# EAGLE board IoT Node(Ver1.0) (EAGLE 9.3.0), part 1 of 2
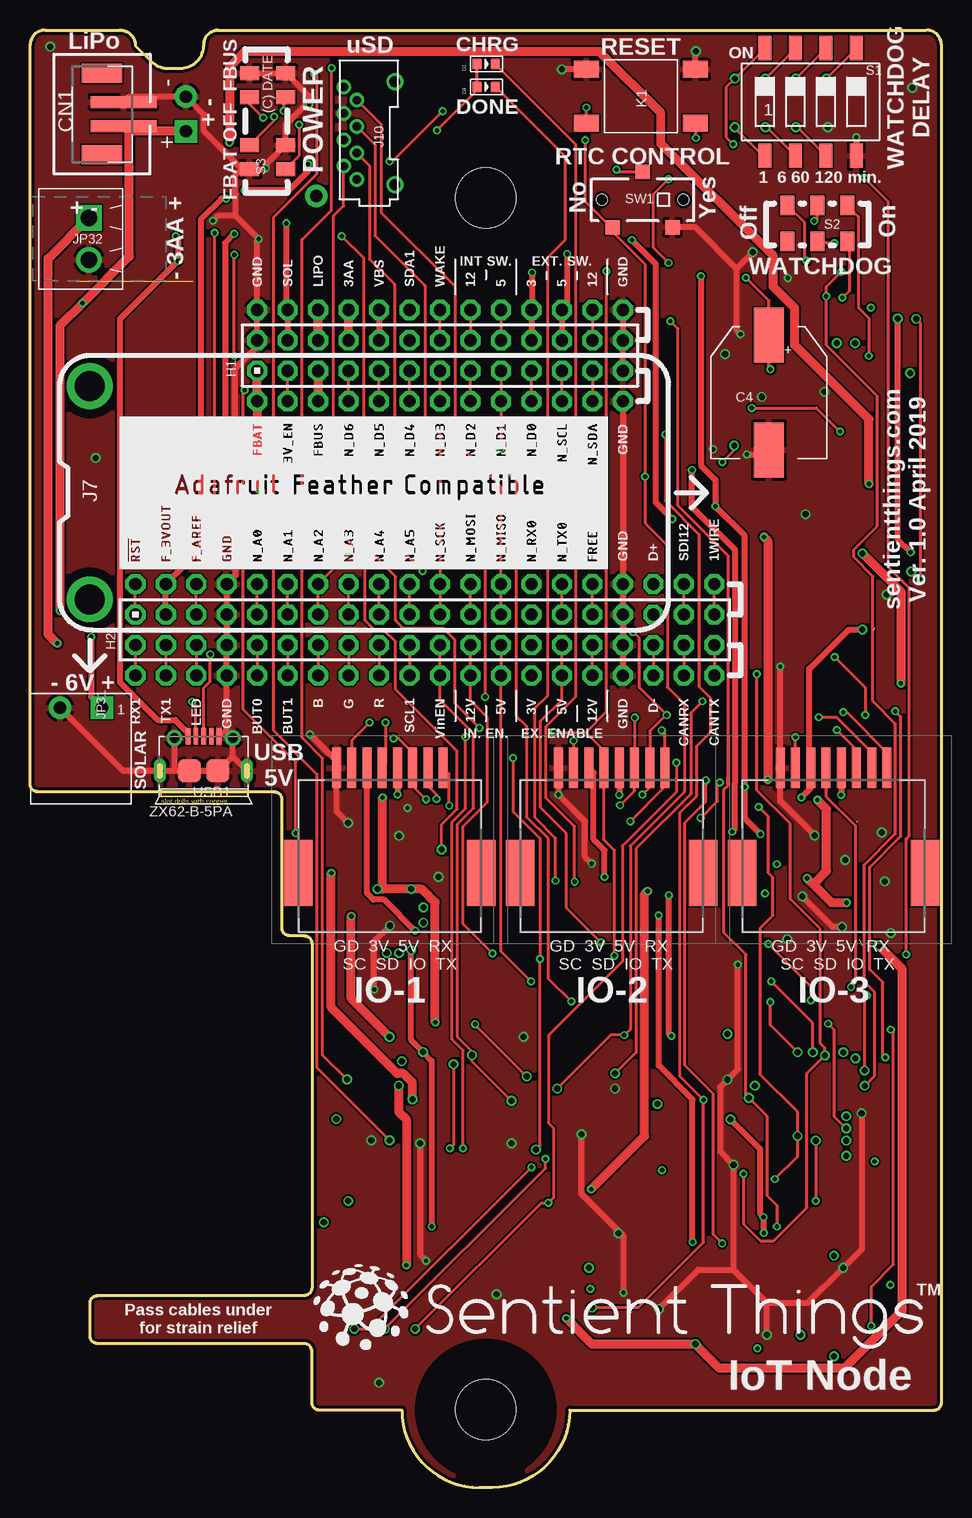
[diagram p1: board, top side]
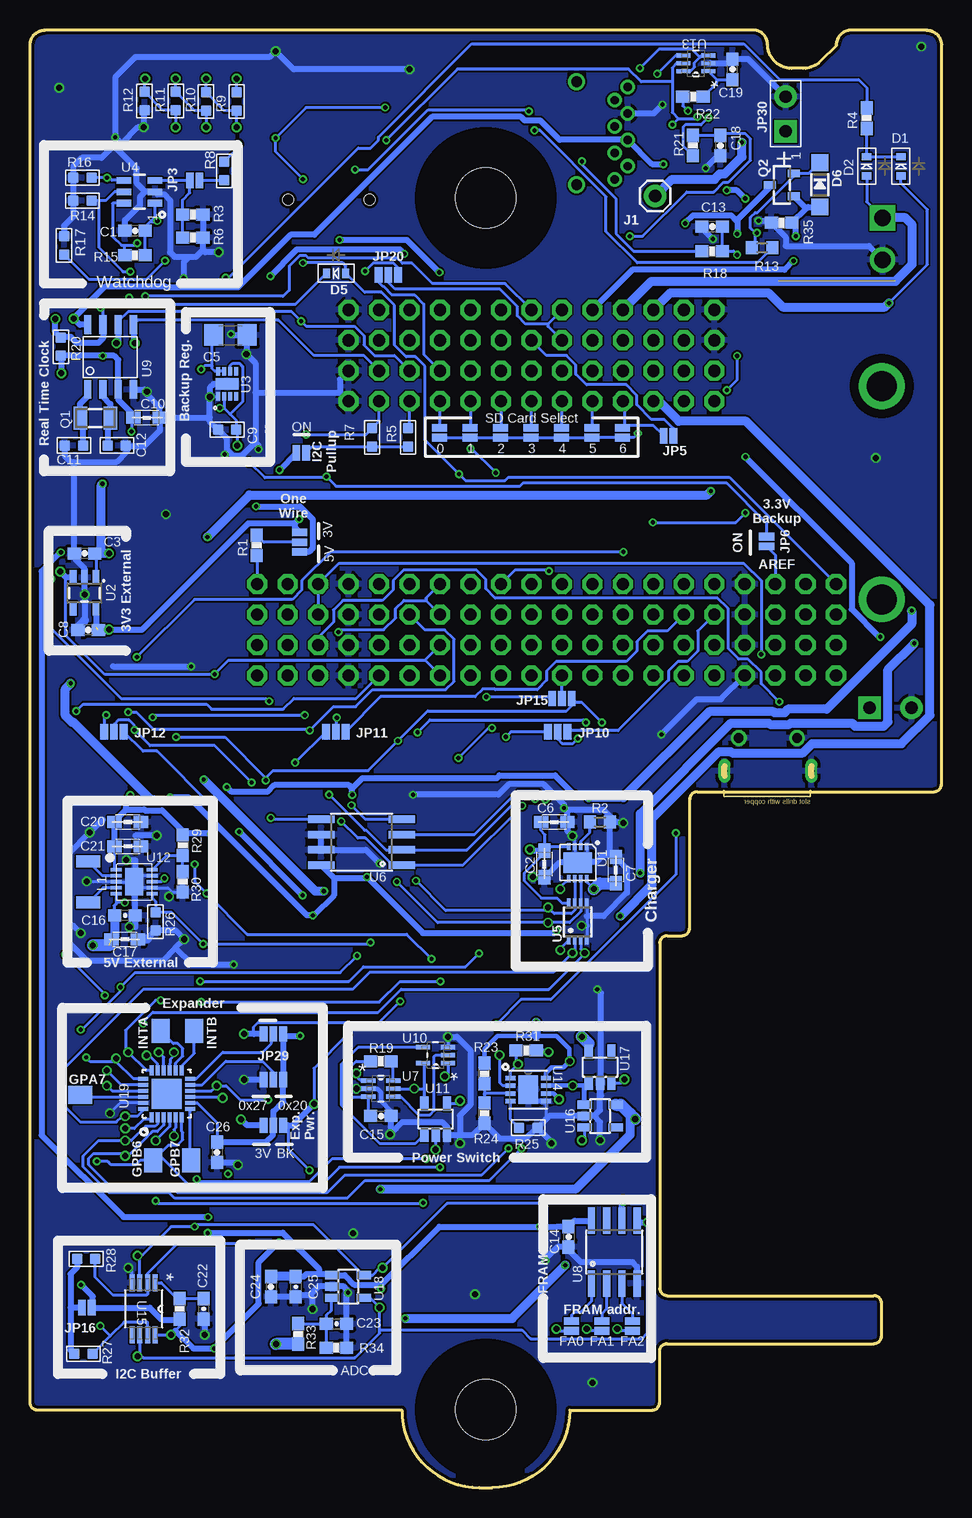
[diagram p2: board, bottom side, seen from below]

Size 76 x 121.5 mm. Coordinates in mm from the lower left corner, seen from the top.
Outline: 20.36,58 0.63,58 arc-90 0,58.63 0,120.23 arc-90 1.27,121.5 7.5,121.5 arc-90 8.79,120.2 10.11,118.89 arc45 11.52,118.3 12.5,118.3 arc90 14.5,120.3 arc-90 15.7,121.5 74.73,121.5 arc-90 76,120.23 76,91.63 76,74.05 76,7.09 arc-90 75.37,6.45 45,6.45 arc-90 38.55,0 37.45,0 arc-90 31,6.45 24.13,6.45 arc-90 23.5,7.09 23.5,11.37 arc90 22.87,12 5.63,12 arc-90 5,12.63 5,15.37 arc-90 5.63,16 22.87,16 arc90 23.5,16.63 23.5,45.37 arc90 22.87,46 21.64,46 arc-90 21,46.63 21,57.37 arc90 20.36,58
Copper layers (1*16): Top 0.035mm / dielectric 1.5mm / Bottom 0.035mm
Design rules "SeeedStudio_2layer_DRU_no_angle_20140221 *": minimum track width 8mil, minimum drill 14mil, track to track 6mil, track to pad 6mil, pad to pad 6mil, via to via 6mil, smd to smd 0mil, copper to edge 10mil, drill to drill 10mil, minimum pad ring 10mil, minimum via ring 6mil, stop-mask expansion 2mil, vias tented up to drill 100mil, thermal gap 10mil
Net classes: 0 default: width 0.254 mm, drill 0.356 mm, clearance 0.152 mm; 1 Power: width 0.508 mm, drill 0.356 mm, clearance 0.152 mm; 2 HighCurrent: width 0.762 mm, drill 0.356 mm, clearance 0.152 mm
Holes 5 mm at 38,107.5 38,6.5
bKeepout: area 34,103.5 to 42,111.5; area 34,2.5 to 42,10.5
tRestrict: area 34,103.5 to 42,111.5; area 34,2.5 to 42,10.5
bRestrict: area 34,103.5 to 42,111.5; area 34,2.5 to 42,10.5

## Footprints (pad centres in the part's own frame; a part is rotated, then mirrored left to right if it is on the bottom)
0603-CAP = smd 1.1 x 1: 1 -0.85,0; 2 0.85,0
0805 = smd 1.2 x 1: 1 -1.1,0; 2 1.1,0
CAP-10.5MM = smd 4.6 x 2.5: +VE 4.8,0; -VE -4.8,0
C1206 = smd 1.6 x 1.8: 1 -1.4,0; 2 1.4,0
C0603 = smd 0.889 x 0.889: 1 0,0.762; 2 0,-0.762
0603 = smd 0.889 x 0.889: 1 -0.762,0; 2 0.762,0
JST-PH-2-SMT = smd 1 x 5.5: 1 -1,-1.8; 2 1,-1.8 | smd 1.6 x 3.4: NC1 -3.4,0; NC2 3.4,0
SOD-523 = smd 0.8 x 0.6: A 0,-0.8; K 0,0.8
D0603 = smd 0.762 x 0.889: + -0.762,0; - 0.762,0
SOD-123 = smd 1.4 x 1.4: A 1.85,0; C -1.85,0
PAD-1.5X4.5 = smd 1.5 x 2: P$1 0,0
73304111LF = smd 3.4 x 0.76: 1 -6,4.445; 2 -6,3.175; 3 -6,1.905; 4 -6,0.635; 5 -6,-0.635; 6 -6,-1.905; 7 -6,-3.175; 8 -6,-4.445 | smd 5.5 x 2.35: MP1 2.75,7.62; MP2 2.75,-7.62
1X01 = drill 1.016 pad 1.88: 1 0,0
M20NODE = drill 1.016 pad 1.676 octagon: 1 0,0; 2 2.54,0; 3 5.08,0; 4 7.62,0; 5 10.16,0; 6 12.7,0; 7 15.24,0; 8 17.78,0; 9 20.32,0; 10 22.86,0; 11 25.4,0; 12 27.94,0; 13 30.48,0; 14 33.02,0; 15 35.56,0; 16 38.1,0; 17 40.64,0; 18 43.18,0; 19 45.72,0; 20 48.26,0
IOTNODE = drill 1.016 pad 1.676 octagon: 1WIRE 29.21,-10.16; 3AA -1.27,12.7; 3VEN -6.35,10.16; 3VEXT 13.97,12.7; 5VEXT 16.51,12.7; 5VINT 11.43,12.7; 12VEXT 19.05,12.7; 12VINT 8.89,12.7; !RST -19.05,-10.16; B -3.81,-12.7; BUT0 -8.89,-12.7; BUT1 -6.35,-12.7; CANRX 26.67,-12.7; CANTX 29.21,-12.7; D+ 24.13,-10.16; D- 24.13,-12.7; EN3VEX 13.97,-12.7; EN5VEX 16.51,-12.7; EN5VIN 11.43,-12.7; EN12VEX 19.05,-12.7; EN12VIN 8.89,-12.7; F3VOUT -16.51,-10.16; FAREF -13.97,-10.16; FBAT -8.89,10.16; FBUS -3.81,10.16; FREE 19.05,-10.16; G -1.27,-12.7; GND -8.89,12.7; GND0 -11.43,-12.7; GND1 21.59,-12.7; GND2 21.59,-10.16; GND3 -11.43,-10.16; GND4 21.59,12.7; GND5 21.59,10.16; LED -13.97,-12.7; LIPO -3.81,12.7; NA0 -8.89,-10.16; NA1 -6.35,-10.16; NA2 -3.81,-10.16; NA3 -1.27,-10.16; NA4 1.27,-10.16; NA5 3.81,-10.16; ND0 13.97,10.16; ND1 11.43,10.16; ND2 8.89,10.16; ND3 6.35,10.16; ND4 3.81,10.16; ND5 1.27,10.16; ND6 -1.27,10.16; NMISO 11.43,-10.16; NMOSI 8.89,-10.16; NRX0 13.97,-10.16; NSCK 6.35,-10.16; NSCL 16.51,10.16; NSDA 19.05,10.16; NTX0 16.51,-10.16; R 1.27,-12.7; RX1 -19.05,-12.7; SCL1 3.81,-12.7; SDA1 3.81,12.7; SDI12 26.67,-10.16; SOL -6.35,12.7; TX1 -16.51,-12.7; VBS 1.27,12.7; VINEN 6.35,-12.7; WAKE 6.35,12.7 | drill 2.5 pad 3.81: P$1 -22.86,8.89; P$2 -22.86,-8.89
1X13NODE = drill 1.016 pad 1.676 octagon: 1 0,0; 2 2.54,0; 3 5.08,0; 4 7.62,0; 5 10.16,0; 6 12.7,0; 7 15.24,0; 8 17.78,0; 9 20.32,0; 10 22.86,0; 11 25.4,0; 12 27.94,0; 13 30.48,0
MICROSDYAMAICHI = drill 0.7 pad 1.016: 1 -3.85,0; 2 -2.75,1.1; 3 -1.65,0; 4 -0.55,1.1; 5 0.55,0; 6 1.65,1.1; 7 2.75,0; 8 3.85,1.1 | drill 0.9: P1 -4.3,-3.17; P2 4.3,-3.17
SMT-JUMPER_3_1-NC_PASTE_NO-SILK = smd 0.635 x 1.27: 1 -0.813,0; 2 0,0; 3 0.813,0
SMT-JUMPER_2_NC_PASTE_NO-SILK = smd 0.635 x 1.27: 1 -0.406,0; 2 0.406,0
SMT-JUMPER_2_NO_NO-SILK = smd 0.635 x 1.27: 1 -0.406,0; 2 0.406,0
1X02_LOCK_FEM = drill 1.016 pad 1.88 square: 1 -1.448,0 | drill 1.016 pad 1.88: 2 1.448,0
1X02-3.5-HOR = drill 1.016 pad 1.88 square: 1 0,0 | drill 1.016 pad 1.88: 2 3.5,0
1X02_3.5TERM = drill 1.4 square: 1 -1.75,0 | drill 1.4: 2 1.75,0
TACTILE6MM-ESWITCH = smd 2.1 x 1.4: 1 -4.55,2.25; 2 -4.55,-2.25; 3 4.55,-2.25; 4 4.55,2.25
2520 = smd 1 x 2: L1 -1.7,0; L2 1.7,0
FC135 = smd 1.1 x 1.9: X1 -1.25,0; X2 1.25,0
SOT23-R = smd 0.635 x 1.016: 1 -0.95,-1; 2 0.95,-1; 3 0,1
0603-RES = smd 1.1 x 1: 1 -0.85,0; 2 0.85,0
R0603 = smd 1 x 1.1: 1 -0.85,0; 2 0.85,0
R0603' = smd 0.889 x 0.889: 1 0,0.762; 2 0,-0.762
SMS-004 = smd 1.092 x 2.007: 1 -3.81,-4.496; 2 -1.27,-4.496; 3 1.27,-4.496; 4 3.81,-4.496; 5 3.81,4.496; 6 1.27,4.496; 7 -1.27,4.496; 8 -3.81,4.496
CL-SB-22A = smd 1.2 x 1.6: 1 -2.5,-1.6; 2(C) 0,-1.6; 3 2.5,-1.6; 4 -2.5,1.4; 5(C) 0,1.4; 6 2.5,1.4
CL-SB-23A = smd 1.2 x 1.6: 1 -4,-1.6; 2 -2,-1.6; 3(C) 2,-1.6; 4 4,-1.6; 5 -4,1.4; 6 -2,1.4; 7(C) 2,1.4; 8 4,1.4
CL-SB-12B = smd 1.2 x 1.2: 1 -2.5,-2.3; 3 2.5,-2.3; C(2) 0,2.3 | hole 0.9: -3.4,0; 3.4,0
DFN8 = smd 0.3 x 0.6: 1 -0.75,-1.35; 2 -0.25,-1.35; 3 0.25,-1.35; 4 0.75,-1.35; 5 0.75,1.35; 6 0.25,1.35; 7 -0.25,1.35; 8 -0.75,1.35 | smd 2.4 x 1.7: HEAT 0,0
SOT23-5 = smd 0.55 x 1.2: 1 -0.95,-1.3; 2 0,-1.3; 3 0.95,-1.3; 4 0.95,1.3; 5 -0.95,1.3
8VDFN = smd 0.3 x 0.7: 1 -0.75,-1.05; 2 -0.25,-1.05; 3 0.25,-1.05; 4 0.75,-1.05; 5 0.75,1.05; 6 0.25,1.05; 7 -0.25,1.05; 8 -0.75,1.05 | smd 1.95 x 0.95: H 0,0
SOT23-6 = smd 0.55 x 1.2: 1 -0.95,-1.3; 2 0,-1.3; 3 0.95,-1.3; 4 0.95,1.3; 5 0,1.3; 6 -0.95,1.3
US8-DCU = smd 0.3 x 0.75: 1 -0.75,-1.5; 2 -0.25,-1.5; 3 0.25,-1.5; 4 0.75,-1.5; 5 0.75,1.6; 6 0.25,1.6; 7 -0.25,1.6; 8 -0.75,1.6
SOIC-8-STANDARD = smd 0.61 x 2.21: 1 -1.905,-3.378; 2 -0.635,-3.378; 3 0.635,-3.378; 4 1.905,-3.378; 5 1.905,3.353; 6 0.635,3.353; 7 -0.635,3.353; 8 -1.905,3.353
SOT65P210X110-6N = smd 1.168 x 0.356: 1 -1.041,0.66; 2 -1.041,0; 3 -1.041,-0.66; 4 1.041,-0.66; 5 1.041,0; 6 1.041,0.66
SO08 = smd 0.61 x 2.21: 1 -1.905,-2.616; 2 -0.635,-2.616; 3 0.635,-2.616; 4 1.905,-2.616; 5 1.905,2.616; 6 0.635,2.616; 7 -0.635,2.616; 8 -1.905,2.616
RTC_MCP7941X = smd 0.6 x 1.55: 1 -1.905,-2.7; 2 -0.635,-2.7; 3 0.635,-2.7; 4 1.905,-2.7; 5 1.905,2.7; 6 0.635,2.7; 7 -0.635,2.7; 8 -1.905,2.7
SOT65P210X110-5N = smd 1.168 x 0.356: 1 -1.041,0.66; 2 -1.041,0; 3 -1.041,-0.66; 4 1.041,-0.66; 5 1.041,0.66
SOT23-5' = smd 0.69 x 1.2: 1 -0.95,-1.3; 2 0,-1.3; 3 0.95,-1.3; 4 0.95,1.3; 5 -0.95,1.3
DFN103X3 = smd 0.9 x 0.3: 1 -1.5,1; 2 -1.5,0.5; 3 -1.5,0; 4 -1.5,-0.5; 5 -1.5,-1; 6 1.5,-1; 7 1.5,-0.5; 8 1.5,0; 9 1.5,0.5; 10 1.5,1 | smd 1.5 x 2.3: G 0,0
SON65P300X300X100-9N = smd 0.813 x 0.381: 1 -1.473,0.965; 2 -1.473,0.33; 3 -1.473,-0.33; 4 -1.473,-0.965; 5 1.473,-0.965; 6 1.473,-0.33; 7 1.473,0.33; 8 1.473,0.965 | smd 1.651 x 2.388: 9 0,0
SOP65P490X110-8N = smd 1.422 x 0.432: 1 -2.184,0.965; 2 -2.184,0.33; 3 -2.184,-0.33; 4 -2.184,-0.965; 5 2.184,-0.965; 6 2.184,-0.33; 7 2.184,0.33; 8 2.184,0.965
QFN24-4MM = smd 0.85 x 0.3: 1 -1.95,1.25; 2 -1.95,0.75; 3 -1.95,0.25; 4 -1.95,-0.25; 5 -1.95,-0.75; 6 -1.95,-1.25; 13 1.95,-1.25; 14 1.95,-0.75; 15 1.95,-0.25; 16 1.95,0.25; 17 1.95,0.75; 18 1.95,1.25 | smd 0.3 x 0.85: 7 -1.25,-1.95; 8 -0.75,-1.95; 9 -0.25,-1.95; 10 0.25,-1.95; 11 0.75,-1.95; 12 1.25,-1.95; 19 1.25,1.95; 20 0.75,1.95; 21 0.25,1.95; 22 -0.25,1.95; 23 -0.75,1.95; 24 -1.25,1.95 | smd 2.5 x 2.5: S 0,0
MICRO-USB5+6P-SMD-0.65-AB = smd 0.4 x 1.35: 1 -1.3,2.875; 2 -0.65,2.875; 3 0,2.875; 4 0.65,2.875; 5 1.3,2.875 | smd 1.9 x 1.9: P1 -1.2,0; P2 1.2,0 | drill 0.508 pad 1.016 long: P3 -3.625,0; P4 3.625,0 | drill 0.8: P5 -2.425,2.73; P6 2.425,2.73

## Placement (x,y rotation side)
C1  1uF  [0603-CAP]  67.24,104.75 180 bottom
C2  10uF  [0805]  33.12,51.97 270 bottom
C3  1uF  [0603-CAP]  71.44,77.87 180 bottom
C4  47mF  [CAP-10.5MM]  61.61,91.28 90 top
C5  100uF 6.3V  [C1206]  59.29,96.07 0 bottom
C6  10uF  [0805]  32.29,55.47 0 bottom
C7  4.7uF  [0805]  27.16,51.46 90 bottom
C8  1uF  [0603-CAP]  71.15,71.48 180 bottom
C9  2.2uf  [C0603]  59.56,88.18 90 bottom
C10  100pF  [0805]  66.27,89.18 180 bottom
C11  9pF  [0603]  72.32,86.87 0 bottom
C12  9pF  [0603]  68.77,86.87 180 bottom
C13  1uF  [0603-CAP]  19.12,105.1 180 bottom
C14  1uF  [0603-CAP]  31.09,20.9 270 bottom
C15  1uF  [0603-CAP]  46.75,30.96 0 bottom
C16  0.1uF  [0603-CAP]  68.08,47.69 180 bottom
C17  10uF  [0805]  68.1,45.7 0 bottom
C18  1uF  [0603-CAP]  18.44,111.86 270 bottom
C19  1uF  [0603-CAP]  17.43,118.21 90 bottom
C20  10uF  [0805]  67.84,55.48 0 bottom
C21  10uF  [0805]  67.84,53.44 0 bottom
C22  0.1uF  [0603-CAP]  61.52,14.9 270 bottom
C23  0.1uF  [0603-CAP]  50.44,13.65 0 bottom
C24  1uF  [0603-CAP]  55.91,16.74 270 bottom
C25  0.1uF  [0603-CAP]  53.84,16.74 270 bottom
C26  1uF  [0603-CAP]  60.41,27.94 270 bottom
CN1  B2B-PH-SM4-TB(LF)(SN)  [JST-PH-2-SMT]  6,114.5 90 top
D1  RB520S30T1G  [SOD-523]  3.38,110.14 0 bottom
D2  RB520S30T1G  [SOD-523]  6.24,110.13 0 bottom
D3  LTST-C193KRKT-5A  [D0603]  38.05,118.66 0 top
D4  LTST-C190KGKT  [D0603]  38.05,116.76 0 top
D5  RB520S30T1G  [SOD-523]  50.48,101.22 90 bottom
D6  BS819W  [SOD-123]  10.14,108.59 270 bottom
FRAME1  FRAME-LEDGER  [CREATIVE_COMMONS]  10.06,-26.82 0 top  (outside the outline)
GPA7  [PAD-1.5X4.5]  71.83,32.73 270 bottom
GPB6  [PAD-1.5X4.5]  65.74,27.27 0 bottom
GPB7  [PAD-1.5X4.5]  62.56,27.27 0 bottom
H1  Pi2x13extratall  [2X13PLACEMENT]  18.95,93.09 0 top
H2  Pi2x20extratall  [2X20PLACEMENT]  8.79,70.23 0 top
INTA  [PAD-1.5X4.5]  65.1,38.06 180 bottom
INTB  [PAD-1.5X4.5]  62.31,38.06 180 bottom
IO-1  [73304111LF]  30,54 270 top
IO-2  [73304111LF]  48.5,54 270 top
IO-3  [73304111LF]  67,54 270 top
J1  [1X01]  23.87,107.66 0 bottom
J5  [M20NODE]  8.79,67.69 0 top
J6  [M20NODE]  8.79,75.31 0 top
J7  [IOTNODE]  27.84,82.93 0 top
J8  [1X13NODE]  18.95,90.55 0 top
J9  [1X13NODE]  18.95,98.17 0 top
J10  PJS008U-3000-0  [MICROSDYAMAICHI]  27.25,112.9 90 top
JP1  JUMPER-SMT_3_1-NC_PASTE_NO-SILK  [SMT-JUMPER_3_1-NC_PASTE_NO-SILK]  53.52,78.81 90 bottom
JP2  JUMPER-SMT_2_NC_PASTE_NO-SILK  [SMT-JUMPER_2_NC_PASTE_NO-SILK]  53.39,86.25 0 bottom
JP3  JUMPER-SMT_2_NC_PASTE_NO-SILK  [SMT-JUMPER_2_NC_PASTE_NO-SILK]  62.27,108.96 0 bottom
JP4  JUMPER-SMT_3_1-NC_PASTE_NO-SILK  [SMT-JUMPER_3_1-NC_PASTE_NO-SILK]  55.7,30.19 180 bottom
JP5  JUMPER-SMT_2_NO_NO-SILK  [SMT-JUMPER_2_NO_NO-SILK]  22.76,87.67 0 bottom
JP6  JUMPER-SMT_2_NO_NO-SILK  [SMT-JUMPER_2_NO_NO-SILK]  14.59,78.87 270 bottom
JP7  JUMPER-SMT_2_NO_NO-SILK  [SMT-JUMPER_2_NO_NO-SILK]  30.85,13.47 90 bottom
JP8  JUMPER-SMT_2_NO_NO-SILK  [SMT-JUMPER_2_NO_NO-SILK]  25.77,13.47 90 bottom
JP9  JUMPER-SMT_2_NO_NO-SILK  [SMT-JUMPER_2_NO_NO-SILK]  28.31,13.47 90 bottom
JP10  JUMPER-SMT_3_1-NC_PASTE_NO-SILK  [SMT-JUMPER_3_1-NC_PASTE_NO-SILK]  32,63 180 bottom
JP11  JUMPER-SMT_3_1-NC_PASTE_NO-SILK  [SMT-JUMPER_3_1-NC_PASTE_NO-SILK]  50.5,63 180 bottom
JP12  JUMPER-SMT_3_1-NC_PASTE_NO-SILK  [SMT-JUMPER_3_1-NC_PASTE_NO-SILK]  69,63 0 bottom
JP13  JUMPER-SMT_2_NC_PASTE_NO-SILK  [SMT-JUMPER_2_NC_PASTE_NO-SILK]  41.85,87.93 90 bottom
JP14  JUMPER-SMT_2_NO_NO-SILK  [SMT-JUMPER_2_NO_NO-SILK]  39.31,87.93 90 bottom
JP15  JUMPER-SMT_3_1-NC_PASTE_NO-SILK  [SMT-JUMPER_3_1-NC_PASTE_NO-SILK]  31.65,65.77 0 bottom
JP16  JUMPER-SMT_2_NC_PASTE_NO-SILK  [SMT-JUMPER_2_NC_PASTE_NO-SILK]  71.26,15 180 bottom
JP17  JUMPER-SMT_2_NO_NO-SILK  [SMT-JUMPER_2_NO_NO-SILK]  36.77,87.93 90 bottom
JP18  JUMPER-SMT_2_NO_NO-SILK  [SMT-JUMPER_2_NO_NO-SILK]  34.23,87.93 90 bottom
JP19  JUMPER-SMT_2_NO_NO-SILK  [SMT-JUMPER_2_NO_NO-SILK]  31.69,87.93 90 bottom
JP20  JUMPER-SMT_3_1-NC_PASTE_NO-SILK  [SMT-JUMPER_3_1-NC_PASTE_NO-SILK]  46.13,101.09 0 bottom
JP21  JUMPER-SMT_2_NO_NO-SILK  [SMT-JUMPER_2_NO_NO-SILK]  29.15,87.93 90 bottom
JP22  JUMPER-SMT_2_NO_NO-SILK  [SMT-JUMPER_2_NO_NO-SILK]  26.61,87.93 90 bottom
JP28  JUMPER-SMT_3_1-NC_PASTE_NO-SILK  [SMT-JUMPER_3_1-NC_PASTE_NO-SILK]  55.7,34 180 bottom
JP29  JUMPER-SMT_3_1-NC_PASTE_NO-SILK  [SMT-JUMPER_3_1-NC_PASTE_NO-SILK]  55.7,37.81 180 bottom
JP30  [1X02_LOCK_FEM]  13,114.5 90 bottom
JP31  [1X02-3.5-HOR]  6,65 180 top
JP32  [1X02_3.5TERM]  4.91,104.09 270 top
K1  PTS645SL50SMTR92 LFS  [TACTILE6MM-ESWITCH]  50.94,115.97 0 top
L1  4.7u MAMK2520T4R7M  [2520]  71.13,50.49 90 bottom
N1  SENTIENTLOGO-ULP  [SENTIENT_THINGS+50MM_TPLACE_BMP]  23.63,11.22 0 top
Q1  FC-135R 32.7680KA-AC3  [FC135]  70.55,89.16 180 bottom
Q2  FDN340P  [SOT23-R]  13.32,108.59 90 bottom
R1  4k7  [0603-RES]  57.09,78.53 90 bottom
R2  2k  [R0603]  28.48,55.47 180 bottom
R3  [0603-RES]  62.43,106.1 180 bottom
R4  27  [0603-RES]  6.25,114.15 90 bottom
R5  10K  [R0603']  44.48,87.53 0 bottom
R6  [0603-RES]  62.43,104.2 180 bottom
R7  10K  [R0603']  47.48,87.53 0 bottom
R8  12k  [R0603']  59.8,109.76 0 bottom
R9  12k  [R0603']  58.77,115.55 0 bottom
R10  22k  [R0603']  61.32,115.55 0 bottom
R11  84.5k  [0603]  63.84,115.58 270 bottom
R12  39.2k  [0603]  66.45,115.58 270 bottom
R13  1k  [R0603]  14.96,103.35 180 bottom
R14  1M  [0603]  71.62,107.28 0 bottom
R15  100k  [0603-RES]  67.24,102.72 0 bottom
R16  1M  [0603]  71.62,109.18 0 bottom
R17  220R  [R0603']  73.16,103.54 0 bottom
R18  100k  [0603-RES]  19.12,103.06 0 bottom
R19  100k  [0603-RES]  46.75,35.54 180 bottom
R20  1M  [0603]  73.42,95.1 270 bottom
R21  100k  [0603-RES]  20.73,111.86 90 bottom
R22  100k  [0603-RES]  20.73,115.93 0 bottom
R23  4M7  [0603-RES]  38.11,34.52 90 bottom
R24  1M5  [0603-RES]  38.11,31.22 90 bottom
R25  220R  [R0603']  34.45,30 270 bottom
R26  1M  [0603]  65.54,47.18 90 bottom
R27  10K  [R0603']  71.55,11.15 270 bottom
R28  10K  [R0603']  71.31,19.05 270 bottom
R29  487k  [0603-RES]  63.25,53.53 270 bottom
R30  53.6k  [0603-RES]  63.25,50.49 90 bottom
R31  3M3  [0603-RES]  34.64,36.45 0 bottom
R32  100k  [0603-RES]  63.52,14.9 270 bottom
R33  4M7  [0603-RES]  53.64,12.81 270 bottom
R34  1M5  [0603-RES]  50.44,11.65 180 bottom
R35  100k  [0603-RES]  13.32,105.42 0 bottom
S1  219-4MST  [SMS-004]  65.08,115.51 0 top
S2  CL-SB-22A-02T  [CL-SB-22A]  65.65,105.28 180 top
S3  CL-SB-23A-01T  [CL-SB-23A]  19.71,113.9 90 top
SW1  CL-SB-12B-01T  [CL-SB-12B]  51.07,107.35 0 top
U1  CN3065  [DFN8]  30.33,52.09 180 bottom
U2  AP2112K-3.3V  [SOT23-5]  71.44,74.57 180 bottom
U3  MCP18102MMX2MM  [8VDFN]  59.56,91.99 0 bottom
U4  TPL5010  [SOT23-6]  66.88,108.01 90 bottom
U5  SN74LVC2T45DCU  [US8-DCU]  30.33,47.14 0 bottom
U6  SMDA05-6TR  [SOIC-8-STANDARD]  48.36,53.79 90 bottom
U7  SN74AUP2G17DCKR  [SOT65P210X110-6N]  46.75,33.25 0 bottom
U8  MB85RC256VPNF-G-JNERE1  [SO08]  27.28,19.63 0 bottom
U9  MCP79412-I/SN  [RTC_MCP7941X]  69.28,94.24 0 bottom
U10  SN74AHC1G02DCKR  [SOT65P210X110-5N]  42.18,36.04 180 bottom
U11  SN74AHC1G32DBVR  [SOT23-5']  42.18,30.71 0 bottom
U12  RT6150AGQW  [DFN103X3]  67.32,50.49 0 bottom
U13  SN74AUP2G14DCKR  [SOT65P210X110-6N]  20.47,118.72 180 bottom
U14  TPS2113ADRBR  [SON65P300X300X100-9N]  34.45,33.17 0 bottom
U15  TCA4311ADGKR  [SOP65P490X110-8N]  66.52,14.9 270 bottom
U16  MAX40200  [SOT23-5']  28.46,30.96 270 bottom
U17  [SOT23-5']  28.46,35.03 0 bottom
U18  MCP3221  [SOT23-5']  49.48,16.75 270 bottom
U19  MCP23018  [QFN24-4MM]  64.6,32.81 90 bottom
USB1  ZX62-B-5PA  [MICRO-USB5+6P-SMD-0.65-AB]  14.48,59.75 0 top